# Altium project STM32-PanTilt.PrjPcb
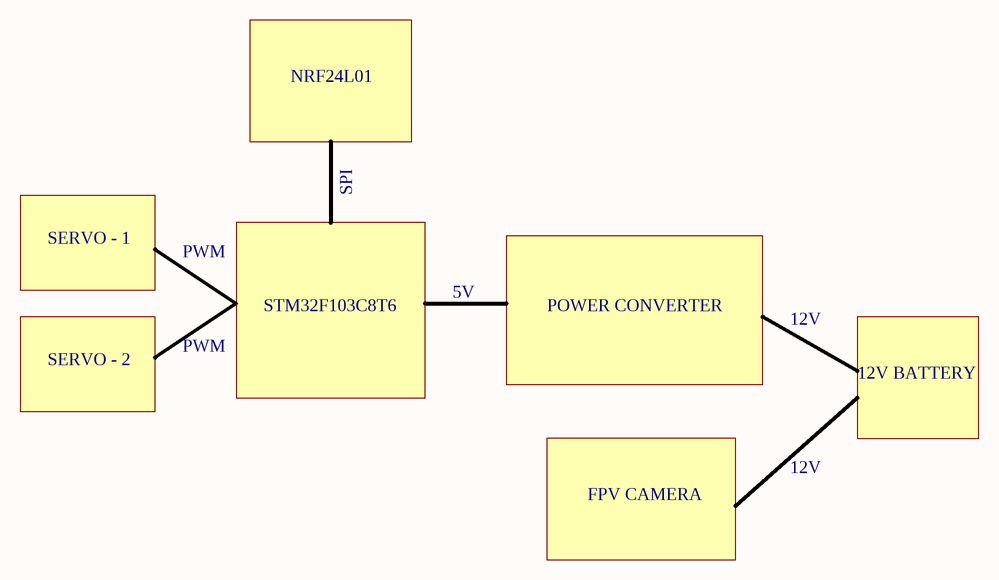
[diagram p0: BlockDiagram.SchDoc]
2 sheets, 48 parts. Net scope: global (net labels, ports and power ports of the same name join across sheets).
Board file: PCB1.PcbDoc
Sheets:
  BlockDiagram.SchDoc
  Schematic.SchDoc

## Sheet BlockDiagram.SchDoc
size A4; SheetNumber: 1; SheetTotal: 1

### Notes on the sheet
- NRF24L01
- SPI
- SERVO - 1
- PWM
- STM32F103C8T6
- 5V
- POWER CONVERTER
- 12V
- SERVO - 2
- 12V BATTERY
- FPV CAMERA

## Sheet Schematic.SchDoc
size A4; SheetNumber: 2; SheetTotal: 2
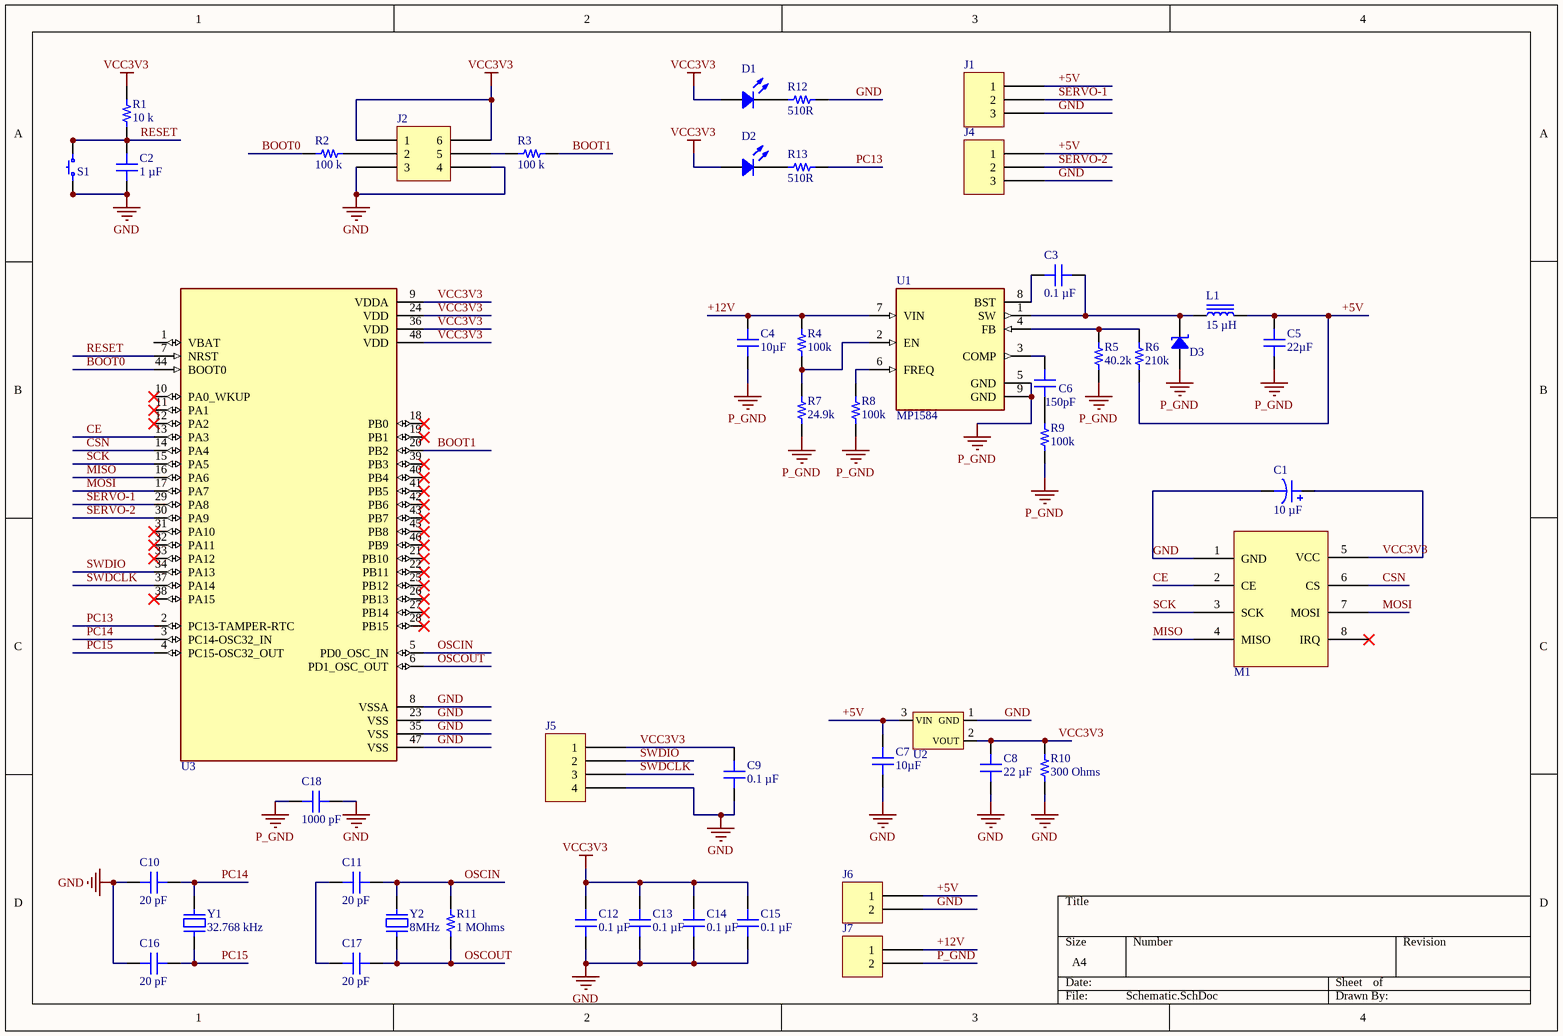
[diagram p1: Schematic.SchDoc]

### Parts
C1  10 µF  [CAP ALSMD 4.3MM H5.4MM]
C2  1 µF  [CAP 0603_1608]
C3  0.1 µF  [CAP 0603_1608]
C4  10µF  [CAP 0805_2012]
C5  22µF  [CAP 0603_1608]
C6  150pF  [CAP 0603_1608]
C7  10µF  [CAP 0603_1608]
C8  22 µF  [CAP 0603_1608]
C9  0.1 µF  [CAP 0603_1608]
C10  20 pF  [CAP 0603_1608]
C11  20 pF  [CAP 0603_1608]
C12  0.1 µF  [CAP 0603_1608]
C13  0.1 µF  [CAP 0603_1608]
C14  0.1 µF  [CAP 0603_1608]
C15  0.1 µF  [CAP 0603_1608]
C16  20 pF  [CAP 0603_1608]
C17  20 pF  [CAP 0603_1608]
C18  1000 pF  [CAP 0603_1608]
D1  Red  [LED 1206_3216 RED]  (value not drawn)
D2  Red  [LED 1206_3216 RED]  (value not drawn)
D3  SMF36A-E3-08  [SMF DO-219AB]  (value not drawn)
J1  B3B-PH-K-S(LF)(SN)  [JST B3B-PH-K]  (value not drawn)
J2  M20-7830342  [HARWIN M20-7830345]  (value not drawn)
J4  B3B-PH-K-S(LF)(SN)  [JST B3B-PH-K]  (value not drawn)
J5  NPPN041BFCN-RC  [SULLINS NPPN041BFCN]  (value not drawn)
J6  OQ0232510000G  [FCI 06-381-2PIN]  (value not drawn)
J7  OQ0232510000G  [FCI 06-381-2PIN]  (value not drawn)
L1  15 µH  [BOURNS SRR1280]
M1  NRF24L01  [NRF24L01]  (value not drawn)
R1  10 k  [RES 0603_1608]
R2  100 k  [RES 0603_1608]
R3  100 k  [RES 0603_1608]
R4  100k  [RES 0603_1608]
R5  40.2k  [RES 0603_1608]
R6  210k  [RES 0603_1608]
R7  24.9k  [RES 0603_1608]
R8  100k  [RES 0603_1608]
R9  100k  [RES 0603_1608]
R10  300 Ohms  [RES 0603_1608]
R11  1 MOhms  [RES 0603_1608]
R12  510R  [RES 0603_1608]
R13  510R  [RES 0603_1608]
S1  1-1977223-1  [TE FSM4JSMA]  (value not drawn)
U1  MP1584  [8-SOIC]
U2  AMS1117-3.3V  [SOT223]  (value not drawn)
U3  STM32F103C8T6  [QFP50P900X900X160-48N]  (value not drawn)
Y1  32.768 kHz  [ABRACON ABS25]
Y2  8MHz  [ABRACON ABLS]

### Nets
GND: C1.2 C2.1 C7.1 C8.1 C9.1 C10.1 C12.1 C13.1 C14.1 C15.1 C16.1 C18.2 J1.3 J2.3 J2.4 J4.3 J5.4 J6.2 M1.1(GND) R10.1 R12.2 S1.1 S1.2 U2.1(GND) U3.8(VSSA) U3.23(VSS) U3.35(VSS) U3.47(VSS)
P_GND: C4.1 C5.1 C18.1 D3.1 J7.2 R5.1 R7.1 R8.1 R9.1 U1.5(GND) U1.9(GND)
VCC3V3: C1.1 C8.2 C9.2 C12.2 C13.2 C14.2 C15.2 D1.1 D2.1 J2.1 J2.6 J5.1 M1.5(VCC) R1.2 R10.2 U2.2(VOUT) U3.9(VDDA) U3.24(VDD) U3.36(VDD) U3.48(VDD)
+5V: C5.2 C7.2 J1.1 J4.1 J6.1 L1.2 R6.1 U2.3(VIN)
+12V: C4.2 J7.1 R4.2 U1.7(VIN)
BOOT0: R2.1 U3.44(BOOT0)
BOOT1: R3.2 U3.20(PB2)
CE: M1.2(CE) U3.13(PA3)
CSN: M1.6(CS) U3.14(PA4)
MISO: M1.4(MISO) U3.16(PA6)
MOSI: M1.7(MOSI) U3.17(PA7)
OSCIN: C11.2 R11.2 U3.5(PD0_OSC_IN) Y2.2
OSCOUT: C17.2 R11.1 U3.6(PD1_OSC_OUT) Y2.1
PC13: R13.2 U3.2(PC13-TAMPER-RTC)
PC14: C10.2 U3.3(PC14-OSC32_IN) Y1.1
PC15: C16.2 U3.4(PC15-OSC32_OUT) Y1.4
RESET: C2.2 R1.1 S1.3 S1.4 U3.7(NRST)
SCK: M1.3(SCK) U3.15(PA5)
SERVO-1: J1.2 U3.29(PA8)
SERVO-2: J4.2 U3.30(PA9)
SWDCLK: J5.3 U3.37(PA14)
SWDIO: J5.2 U3.34(PA13)
NetC3_1: C3.1 U1.8(BST)
NetC3_2: C3.2 D3.2 L1.1 U1.1(SW)
NetC6_1: C6.1 R9.2
NetC6_2: C6.2 U1.3(COMP)
NetC11_1: C11.1 C17.1
NetD1_2: D1.2 R12.1
NetD2_2: D2.2 R13.1
NetJ2_2: J2.2 R2.2
NetJ2_5: J2.5 R3.1
NetR4_1: R4.1 R7.2 U1.2(EN)
NetR5_2: R5.2 R6.2 U1.4(FB)
NetR8_2: R8.2 U1.6(FREQ)

Not connected (* = marked no-connect by the designer): M1 8(IRQ)*; U3 1(VBAT) 10(PA0_WKUP)* 11(PA1)* 12(PA2)* 18(PB0)* 19(PB1)* 21(PB10)* 22(PB11)* 25(PB12)* 26(PB13)* 27(PB14)* 28(PB15)* 31(PA10)* 32(PA11)* 33(PA12)* 38(PA15)* 39(PB3)* 40(PB4)* 41(PB5)* 42(PB6)* 43(PB7)* 45(PB8)* 46(PB9)*

### Library data of the parts
C1 = UWX1C100MCL1GB: CAP ALUM 10UF 20% 16V SMD; manufacturer: Nichicon; Lifetime @ Temp.: 2000 Hrs @ 85°C; Polarization: Polar; Ripple Current @ High Frequency: 34.5 mA @ 10 kHz; Ripple Current @ Low Frequency: 23 mA @ 120 Hz; Surface Mount Land Size: 0.169" L x 0.169" W (4.30mm x 4.30mm); Part Number: UWX1C100MCL1GB; Applications: General Purpose; Capacitance: 10 µF; componentlink1description: Datasheet; componentlink1url: https://products.nichicon.co.jp/en/pdf/XJA043/e-uwx.pdf; componentlink2description: DigiKey Link; componentlink2url: https://www.digikey.com/en/products/detail/nichicon/UWX1C100MCL1GB/589841; Device Package: Radial, Can - SMD; Height - Seated (Max): 0.213" (5.40mm); lastupdated: 4.02.2023 20:43:08; Lifecycle Status: Active; Minimum Order: 1; Mounting Type: Surface Mount; Operating Temperature: -40°C ~ 85°C; Package / Case: Radial, Can - SMD; packaging: TapeAndReel; partid: 7030; Part Status: Active; price: 0.06; series: UWX; Size / Dimension: 0.157" Dia (4.00mm); Supplier 1: DigiKey; Supplier Part Number 1: 493-2100-1-ND; Tolerance: ±20%; value: 10 µF; Voltage - Rated: 16 V
C2 = C0603C105K4RACAUTO: CAP CER 1UF 16V X7R 0603; manufacturer: KEMET; Tolerance: ±10%; Part Number: C0603C105K4RACAUTO; Value: 1 µF; Applications: Automotive, Bypass, Decoupling; Capacitance: 1 µF; componentlink1description: Datasheet; componentlink1url: https://api.kemet.com/component-edge/download/datasheet/C0603C105K4RACAUTO.pdf; componentlink2description: DigiKey Link; componentlink2url: https://www.digikey.com/en/products/detail/kemet/C0603C105K4RACAUTO/8635831; Device Package: 0603 (1608 Metric); lastupdated: 4.02.2023 20:08:09; Lifecycle Status: Active; Minimum Order: 0; Mounting Type: Surface Mount, MLCC; Operating Temperature: -55°C ~ 125°C; Package / Case: 0603 (1608 Metric); partid: 2179; Part Status: Active; price: 0; Ratings: AEC-Q200; series: SMD Auto X7R; Size / Dimension: 0.063" L x 0.031" W (1.60mm x 0.80mm); Supplier 1: DigiKey; Supplier Part Number 1: 399-17704-2-ND; Temperature Coefficient: X7R; Thickness (Max): 0.037" (0.95mm); Voltage - Rated: 16V
C3 = C0603C104K5RAC7411: CAP CER 0.1UF 50V X7R 0603; manufacturer: KEMET; Tolerance: ±10%; Part Number: C0603C104K5RAC7411; Value: 0.1 µF; Applications: Bypass, Decoupling; Capacitance: 0.1 µF; componentlink1description: Datasheet; componentlink1url: https://api.kemet.com/component-edge/download/datasheet/C0603C104K5RAC7411.pdf; componentlink2description: DigiKey Link; componentlink2url: https://www.digikey.com/en/products/detail/kemet/C0603C104K5RAC7411/3317013; Device Package: 0603 (1608 Metric); lastupdated: 4.02.2023 20:08:09; Lifecycle Status: Active; Minimum Order: 1; Mounting Type: Surface Mount, MLCC; Operating Temperature: -55°C ~ 125°C; Package / Case: 0603 (1608 Metric); packaging: TapeAndReel; partid: 2233; Part Status: Active; price: 0.01; series: SMD Comm X7R; Size / Dimension: 0.063" L x 0.031" W (1.60mm x 0.80mm); Supplier 1: DigiKey; Supplier Part Number 1: 399-C0603C104K5RAC7411CT-ND; Temperature Coefficient: X7R; Thickness (Max): 0.035" (0.90mm); Voltage - Rated: 50V
C4 = GRM21BR61H106KE43L: CAP CER 10UF 50V X5R 0805; manufacturer: Murata Electronics; Tolerance: ±10%; Part Number: GRM21BR61H106KE43L; Value: 10µF; Applications: General Purpose; Capacitance: 10 µF; componentlink1description: Datasheet; componentlink1url: https://search.murata.co.jp/Ceramy/image/img/A01X/G101/ENG/GRM21BR61H106KE43-01A.pdf; componentlink2description: DigiKey Link; componentlink2url: https://www.digikey.com/en/products/detail/murata-electronics/GRM21BR61H106KE43L/10326316; Device Package: 0805 (2012 Metric); lastupdated: 4.02.2023 20:11:05; Lifecycle Status: Active; Minimum Order: 1; Mounting Type: Surface Mount, MLCC; Operating Temperature: -55°C ~ 85°C; Package / Case: 0805 (2012 Metric); packaging: TapeAndReel; partid: 39284; Part Status: Active; price: 0.05; series: GRM; Size / Dimension: 0.079" L x 0.049" W (2.00mm x 1.25mm); Supplier 1: DigiKey; Supplier Part Number 1: 490-18663-1-ND; Temperature Coefficient: X5R; Thickness (Max): 0.057" (1.45mm); Voltage - Rated: 50V
C5 = 06036D226MAT2A: CAP CER 22UF 6.3V X5R 0603; manufacturer: AVX Corporation; Tolerance: ±20%; Part Number: 06036D226MAT2A; Value: 22µF; Applications: General Purpose; Capacitance: 22µF; componentlink1description: Datasheet; componentlink1url: http://datasheets.avx.com/cx5r.pdf; componentlink2description: DigiKey Link; componentlink2url: http://digikey.com/product-detail/en/avx-corporation/06036D226MAT2A/478-10812-1-ND/7536349; Device Package: 0603 (1608 Metric); lastupdated: 2.09.2020 01:03:16; Lifecycle Status: Active; Minimum Order: 1; Mounting Type: Surface Mount, MLCC; Operating Temperature: -55°C ~ 85°C; Package / Case: 0603 (1608 Metric); packaging: TapeAndReel; partid: 13180; Part Status: Active; price: 0.10; series: -; Size / Dimension: 0.063" L x 0.032" W (1.60mm x 0.81mm); Supplier 1: DigiKey; Supplier Part Number 1: 478-10812-1-ND; Temperature Coefficient: X5R; Thickness (Max): 0.040" (1.02mm); Voltage - Rated: 6.3V
C6 = 885012206029: CAP CER 150PF 16V X7R 0603; manufacturer: Würth Elektronik; Tolerance: ±10%; Part Number: 885012206029; Value: 150pF; Applications: General Purpose; Capacitance: 150 pF; componentlink1description: Datasheet; componentlink1url: https://katalog.we-online.de/pbs/datasheet/885012206029.pdf; componentlink2description: DigiKey Link; componentlink2url: https://www.digikey.com/en/products/detail/würth-elektronik/885012206029/5453803; Device Package: 0603 (1608 Metric); lastupdated: 4.02.2023 20:08:05; Lifecycle Status: Active; Minimum Order: 1; Mounting Type: Surface Mount, MLCC; Operating Temperature: -55°C ~ 125°C; Package / Case: 0603 (1608 Metric); packaging: TapeAndReel; partid: 3529; Part Status: Active; price: 0.02; series: WCAP-CSGP; Size / Dimension: 0.063" L x 0.031" W (1.60mm x 0.80mm); Supplier 1: DigiKey; Supplier Part Number 1: 732-7948-1-ND; Temperature Coefficient: X7R; Thickness (Max): 0.034" (0.87mm); Voltage - Rated: 16V
C7 = GRM188R60J106ME47D: CAP CER 10UF 6.3V X5R 0603; manufacturer: Murata Electronics; Tolerance: ±20%; Part Number: GRM188R60J106ME47D; Value: 10µF; Applications: General Purpose; Capacitance: 10 µF; componentlink1description: Datasheet; componentlink1url: https://www.murata.com/~/media/webrenewal/support/library/catalog/products/capacitor/mlcc/c02e.ashx?la=en-us; componentlink2description: DigiKey Link; componentlink2url: https://www.digikey.com/en/products/detail/murata-electronics/GRM188R60J106ME47D/965910; Device Package: 0603 (1608 Metric); lastupdated: 4.02.2023 20:08:08; Lifecycle Status: Active; Minimum Order: 1; Mounting Type: Surface Mount, MLCC; Operating Temperature: -55°C ~ 85°C; Package / Case: 0603 (1608 Metric); packaging: TapeAndReel; partid: 2351; Part Status: Active; price: 0.02; series: GRM; Size / Dimension: 0.063" L x 0.031" W (1.60mm x 0.80mm); Supplier 1: DigiKey; Supplier Part Number 1: 490-3896-1-ND; Temperature Coefficient: X5R; Thickness (Max): 0.035" (0.90mm); Voltage - Rated: 6.3V
C8 = GRM186R60J226ME15D: CAP CER 22UF 6.3V X5R 0603; manufacturer: Murata Electronics; Tolerance: ±20%; Part Number: GRM186R60J226ME15D; Value: 22 µF; Applications: General Purpose; Capacitance: 22 µF; componentlink1description: Datasheet; componentlink1url: https://psearch.en.murata.com/capacitor/product/GRM186R60J226ME15%23.pdf; componentlink2description: DigiKey Link; componentlink2url: https://www.digikey.com/en/products/detail/murata-electronics/GRM186R60J226ME15D/5877404; Device Package: 0603 (1608 Metric); lastupdated: 4.02.2023 20:08:08; Lifecycle Status: Active; Minimum Order: 1; Mounting Type: Surface Mount, MLCC; Operating Temperature: -55°C ~ 85°C; Package / Case: 0603 (1608 Metric); packaging: TapeAndReel; partid: 2353; Part Status: Active; price: 0.05; series: GRM; Size / Dimension: 0.063" L x 0.031" W (1.60mm x 0.80mm); Supplier 1: DigiKey; Supplier Part Number 1: 490-13241-1-ND; Temperature Coefficient: X5R; Thickness (Max): 0.024" (0.60mm); Voltage - Rated: 6.3V
C9 C12-C15 = CS0603KRX7R7BB104: CAP CER 0.1UF 16V X7R 0603; manufacturer: Yageo; Tolerance: ±10%; Part Number: CS0603KRX7R7BB104; Value: 0.1 µF; Applications: Boardflex Sensitive; Capacitance: 0.1 µF; componentlink1description: Datasheet; componentlink1url: http://www.yageo.com/NewPortal/yageodocoutput?fileName=/pdf/MLCC/UPY-ST_NPOX7R_16V-to-3KV_5.pdf; componentlink2description: DigiKey Link; componentlink2url: https://www.digikey.com/en/products/detail/yageo/CS0603KRX7R7BB104/6097897; Device Package: 0603 (1608 Metric); Features: Soft Termination; lastupdated: 4.02.2023 20:08:08; Lifecycle Status: Active; Minimum Order: 1; Mounting Type: Surface Mount, MLCC; Operating Temperature: -55°C ~ 125°C; Package / Case: 0603 (1608 Metric); packaging: TapeAndReel; partid: 2286; Part Status: Active; price: 0.01; series: CS; Size / Dimension: 0.063" L x 0.031" W (1.60mm x 0.80mm); Supplier 1: DigiKey; Supplier Part Number 1: 311-3560-1-ND; Temperature Coefficient: X7R; Thickness (Max): 0.037" (0.95mm); Voltage - Rated: 16V
C10 C11 C16 C17 = C0603C200K4GAC7867: CAP CER 20PF 16V NP0 0603; manufacturer: KEMET; Temperature Coefficient: C0G, NP0; Tolerance: ±10%; Part Number: C0603C200K4GAC7867; Value: 20 pF; Applications: General Purpose; Capacitance: 20 pF; componentlink1description: Datasheet; componentlink1url: https://api.kemet.com/component-edge/download/datasheet/C0603C200K4GACTU.pdf; componentlink2description: DigiKey Link; componentlink2url: https://www.digikey.com/en/products/detail/kemet/C0603C200K4GAC7867/2200148; Device Package: 0603 (1608 Metric); Features: Low ESL; lastupdated: 4.02.2023 20:08:00; Lifecycle Status: Active; Minimum Order: 1; Mounting Type: Surface Mount, MLCC; Operating Temperature: -55°C ~ 125°C; Package / Case: 0603 (1608 Metric); packaging: TapeAndReel; partid: 5328; Part Status: Active; price: 0.04; series: SMD Comm C0G; Size / Dimension: 0.063" L x 0.031" W (1.60mm x 0.80mm); Supplier 1: DigiKey; Supplier Part Number 1: 399-14498-1-ND; Thickness (Max): 0.034" (0.87mm); Voltage - Rated: 16V
C18 = C0603C102K4RECAUTO: CAP CER 0603 1NF 16V X7R 10%; manufacturer: KEMET; Part Number: C0603C102K4RECAUTO; Value: 1000 pF; Applications: Automotive, ESD Protection; Capacitance: 1000 pF; componentlink1description: Datasheet; componentlink1url: https://api.kemet.com/component-edge/download/datasheet/C0603C102K4RECAUTO.pdf; componentlink2description: DigiKey Link; componentlink2url: https://www.digikey.com/en/products/detail/kemet/C0603C102K4RECAUTO/8640472; Device Package: 0603 (1608 Metric); lastupdated: 5.02.2023 20:08:00; Lifecycle Status: Active; Minimum Order: 1; Mounting Type: Surface Mount, MLCC; Operating Temperature: -55°C ~ 125°C; Package / Case: 0603 (1608 Metric); packaging: TapeAndReel; partid: 2316; Part Status: Active; price: 0.01; Ratings: AEC-Q200; series: ESD SMD Auto X7R; Size / Dimension: 0.063" L x 0.031" W (1.60mm x 0.80mm); Supplier 1: DigiKey; Supplier Part Number 1: 399-17878-1-ND; Temperature Coefficient: X7R; Thickness (Max): 0.034" (0.87mm); Tolerance: ±10%; Voltage - Rated: 16V
D1 D2 = APTD3216EC: LED RED CLEAR 2SMD; Manufacturer: Kingbright; Configuration: Standard; Current - Test: 20mA; Lens Color: Colorless; Lens Size: 1.60mm Dia; Lens Style: Round with Domed Top; Millicandela Rating: 50mcd; Viewing Angle: 35°; Voltage - Forward (Vf) (Typ): 2V; Wavelength - Dominant: 617nm; Wavelength - Peak: 627nm; Part Number: APTD3216EC; Color: Red; ComponentLink1Description: Datasheet; ComponentLink1URL: http://www.kingbrightusa.com/images/catalog/SPEC/APTD3216EC.pdf; ComponentLink2Description: DigiKey Link; ComponentLink2URL: https://www.digikey.com/en/products/detail/kingbright/APTD3216EC/1747552; Device Package: 1206 (3216 Metric); Height (Max): 1.90mm; LastUpdated: 4.02.2023 20:48:33; Lens Transparency: Clear; Lifecycle Status: Active; Minimum Order: 1; Mounting Type: Surface Mount; Package / Case: 1206 (3216 Metric); Packaging: TapeAndReel; PartId: 193; Part Status: Active; Price: 0.07; Series: -; Size / Dimension: 3.20mm L x 1.60mm W; Supplier 1: DigiKey; Supplier Part Number 1: 754-1153-1-ND; Supplier Device Package: 2-SMD; Value: Red
D3 = SMF36A-E3-08: TVS DIODE 36V 58.1V SMF; Manufacturer: Vishay Semiconductor Diodes Division; Capacitance @ Frequency: 178pF @ 1MHz; Current - Peak Pulse (10/1000µs): 3.4A; Power Line Protection: No; Power - Peak Pulse: 200W; Type: Zener; Unidirectional Channels: 1; Voltage - Breakdown (Min): 40V; Part Number: SMF36A-E3-08; Applications: General Purpose; ComponentLink1Description: Datasheet; ComponentLink1URL: http://www.vishay.com/docs/85881/smf5v0atosmf58a.pdf; ComponentLink2Description: DigiKey Link; ComponentLink2URL: http://digikey.com/product-detail/en/vishay-semiconductor-diodes-division/SMF36A-E3-08/SMF36A-E3-08CT-ND/1680635; LastUpdated: 4.02.2023 21:00:37; Lifecycle Status: Active; Minimum Order: 1; Mounting Type: Surface Mount; Operating Temperature: -65°C ~ 175°C (TJ); Package / Case: DO-219AB; Packaging: TapeAndReel; PartId: 5530; Part Status: Active; Price: 0.10; Series: -; Supplier 1: DigiKey; Supplier Part Number 1: SMF36A-E3-08CT-ND; Supplier Device Package: SMF; Voltage - Clamping (Max) @ Ipp: 58.1V; Voltage - Reverse Standoff (Typ): 36V
J1 J4 = B3B-PH-K-S(LF)(SN): CONN HEADER VERT 3POS 2MM; Manufacturer: JST Sales America Inc.; Contact Length - Mating: 0.130" (3.30mm); Contact Length - Post: 0.134" (3.40mm); Current Rating (Amps): 2A; Material Flammability Rating: UL94 V-0; Number of Positions: 3; Number of Positions Loaded: All; Overall Contact Length: 0.333" (8.45mm); Pitch - Mating: 0.079" (2.00mm); Shrouding: Shrouded - 4 Wall; Style: Board to Cable/Wire; Voltage Rating: 100V; Part Number: B3B-PH-K-S(LF)(SN); ComponentLink1Description: Datasheet; ComponentLink1URL: http://www.jst-mfg.com/product/pdf/eng/ePH.pdf; ComponentLink2Description: DigiKey Link; ComponentLink2URL: http://digikey.com/product-detail/en/jst-sales-america-inc/B3B-PH-K-S-LF-SN/455-1705-ND/926612; Connector Type: Header; Contact Finish - Mating: Tin; Contact Finish - Post: Tin; Contact Material: Brass; Contact Shape: Square; Contact Type: Male Pin; Fastening Type: Detent Lock; Insulation Color: Natural; Insulation Height: 0.236" (6.00mm); Insulation Material: Polyamide (PA66), Nylon 6/6; LastUpdated: 12.01.2020 22:29:26; Lifecycle Status: Active; Minimum Order: 1; Mounting Type: Through Hole; Number of Rows: 1; Operating Temperature: -25°C ~ 85°C; Packaging: Bulk; PartId: 26; Part Status: Active; Price: 0.19; Series: PH; Supplier 1: DigiKey; Supplier Part Number 1: 455-1705-ND; Termination: Press-Fit, Solder
J2 = M20-7830342: CONN RCPT 6POS 0.1 GOLD PCB; Manufacturer: Harwin Inc.; Connector Type: Receptacle; Contact Length - Post: 0.118" (3.00mm); Current Rating (Amps): 3A; Mated Stacking Heights: 11.04mm, 12.63mm; Material Flammability Rating: UL94 V-0; Number of Positions: 6; Number of Positions Loaded: All; Pitch - Mating: 0.100" (2.54mm); Style: Board to Board or Cable; Part Number: M20-7830342; ComponentLink1Description: Datasheet; ComponentLink1URL: https://cdn.harwin.com/pdfs/Harwin_PC_Connectors_M20.pdf; ComponentLink2Description: DigiKey Link; ComponentLink2URL: https://www.digikey.com/en/products/detail/harwin-inc/M20-7830342/3727749; Contact Finish - Mating: Gold; Contact Finish - Post: Tin; Contact Finish Thickness - Mating: Flash; Contact Type: Female Socket; Fastening Type: Push-Pull; Insulation Color: Black; Insulation Height: 0.335" (8.51mm); LastUpdated: 21.09.2022 19:03:32; Lifecycle Status: Active; Minimum Order: 1; Mounting Type: Through Hole; Number of Rows: 2; Operating Temperature: -40°C ~ 105°C; Packaging: Tube; Part Status: Active; Price: 0.67; Row Spacing - Mating: 0.100" (2.54mm); Series: M20; Supplier 1: DigiKey; Supplier Part Number 1: 952-1780-ND; Termination: Solder
J5 = NPPN041BFCN-RC: CONN HDR 4POS 0.079 GOLD PCB; Manufacturer: Sullins Connector Solutions; Connector Type: Header; Contact Length - Post: 0.094" (2.40mm); Current Rating (Amps): 2A; Material Flammability Rating: UL94 V-0; Number of Positions: 4; Number of Positions Loaded: All; Pitch - Mating: 0.079" (2.00mm); Style: Board to Board; Part Number: NPPN041BFCN-RC; ComponentLink1Description: Datasheet; ComponentLink1URL: https://drawings-pdf.s3.amazonaws.com/10483.pdf; ComponentLink2Description: DigiKey Link; ComponentLink2URL: https://www.digikey.com/en/products/detail/sullins-connector-solutions/NPPN041BFCN-RC/804806; Contact Finish - Mating: Gold; Contact Finish - Post: Gold; Contact Finish Thickness - Mating: Flash; Contact Type: Female Socket; Fastening Type: Push-Pull; Insulation Color: Black; Insulation Height: 0.173" (4.40mm); LastUpdated: 21.06.2022 14:42:51; Lifecycle Status: Active; Minimum Order: 1; Mounting Type: Through Hole; Number of Rows: 1; Operating Temperature: -40°C ~ 105°C; Packaging: Tube; Part Status: Active; Price: 0.30; Series: -; Supplier 1: DigiKey; Supplier Part Number 1: S5751-04-ND; Termination: Solder
J6 J7 = OQ0232510000G: TERM BLOCK HDR 2POS 90DEG 3.81MM; Manufacturer: Amphenol Anytek; Current - UL: 10A; Header Orientation: 90°, Right Angle; Number of Levels: 1; Number of Positions: 2; Pitch: 0.150" (3.81mm); Voltage - UL: 300V; Part Number: OQ0232510000G; Color: Green; ComponentLink1Description: Datasheet; ComponentLink1URL: http://portal.fciconnect.com/Comergent//fci/drawing/oqxx32x100j0g.pdf; ComponentLink2Description: DigiKey Link; ComponentLink2URL: //digikey.com/product-detail/en/amphenol-anytek/OQ0232510000G/609-3819-ND/2261255; Contact Mating Finish: Tin; LastUpdated: 16.12.2019 19:14:30; Lifecycle Status: 0; Minimum Order: 1; Mounting Type: Through Hole; Operating Temperature: -40°C ~ 115°C; Packaging: Bulk; Part Status: Active; Positions Per Level: 2; Price: 0.49; Series: 06-381; Supplier 1: DigiKey; Supplier Part Number 1: 609-3819-ND; Termination Style: Solder; Type: Header, Male Pins, Shrouded (4 Side)
L1 = SRR1280-150M: FIXED IND 15UH 5.2A 28.5MOHM SMD; Manufacturer: Bourns Inc.; Current - Saturation: 5A; DC Resistance (DCR): 28.5mOhm Max; Frequency - Self Resonant: 13MHz; Inductance Frequency - Test: 100 kHz; Material - Core: Ferrite; Q @ Freq: 26 @ 2.52MHz; Shielding: Shielded; Tolerance: ±20%; Type: Drum Core, Wirewound; Part Number: SRR1280-150M; ComponentLink1Description: Datasheet; ComponentLink1URL: https://www.bourns.com/docs/Product-Datasheets/SRR1280.pdf; ComponentLink2Description: DigiKey Link; ComponentLink2URL: https://www.digikey.com/en/products/detail/bourns-inc/SRR1280-150M/1969994; Current Rating (Amps): 5.2 A; Device Package: Nonstandard; Height - Seated (Max): 0.315" (8.00mm); Inductance: 15 µH; LastUpdated: 4.02.2023 20:50:03; Lifecycle Status: Active; Minimum Order: 1; Mounting Type: Surface Mount; Operating Temperature: -40°C ~ 125°C; Package / Case: Nonstandard; Packaging: TapeAndReel; PartId: 20; Part Status: Active; Price: 0.54; Series: SRR1280; Size / Dimension: 0.492" L x 0.492" W (12.50mm x 12.50mm); Supplier 1: DigiKey; Supplier Part Number 1: SRR1280-150MCT-ND; Value: 15 µH
M1 = NRF24L01: NRF24L01+MODULE; Manufacturer: Seeed Studio; Manufacturer Part Number: 113990011; Interface: SPI; Frequency: 2.4GHz; Data Rate: 2Mbps; Sensitivity: -85dBm; Current - Receiving: 12.3mA; Current - Transmitting: 11.3mA; Designed by: Semih AŞÇI; Supplier 1: Digi-Key; RoHS: No; Mount: Surface Mount; Case/Package: SMD/SMT; Min Operating Temperature: -40°C; Max Operating Temperature: 85°C; Packaging: Bulk; ComponentLink1URL: http://www.seeedstudio.com/document/pdf/DS_nRF24L01.pdf?src-supplier=Digi-Key; ComponentLink1Description: http://www.seeedstudio.com/document/pdf/DS_nRF24L01.pdf?src-supplier=Digi-Key; Supplier Part Number 1: 1597-1352-ND
R1 = RNCS0603BKE10K0: RES 10K OHM 0.1% 1/16W 0603; Manufacturer: Stackpole Electronics Inc; Power (Watts): 0.063W, 1/16W; Resistance: 10 kOhms; Temperature Coefficient: ±25ppm/°C; Part Number: RNCS0603BKE10K0; Value: 10 k; ComponentLink1Description: Datasheet; ComponentLink1URL: https://www.seielect.com/catalog/sei-rncs_rnch.pdf; ComponentLink2Description: DigiKey Link; ComponentLink2URL: https://www.digikey.com/en/products/detail/stackpole-electronics-inc/RNCS0603BKE10K0/1708836; Composition: Thin Film; Device Package: 0603 (1608 Metric); Features: Anti-Corrosive, Automotive AEC-Q200, Moisture Resistant; Height - Seated (Max): 0.022" (0.55mm); LastUpdated: 3.02.2023 20:29:34; Lifecycle Status: Active; Minimum Order: 1; Number of Terminations: 2; Operating Temperature: -55°C ~ 155°C; Package / Case: 0603 (1608 Metric); Packaging: TapeAndReel; PartId: 4838; Part Status: Active; Price: 0.07; Ratings: AEC-Q200; Series: RNCS; Size / Dimension: 0.061" L x 0.031" W (1.55mm x 0.80mm); Supplier 1: DigiKey; Supplier Part Number 1: RNCS0603BKE10K0CT-ND; Supplier Device Package: 0603; Tolerance: ±0.1%
R2-R4 R8 R9 = RNCS0603BKE100K: RES 100K OHM 0.1% 1/16W 0603; Manufacturer: Stackpole Electronics Inc; Power (Watts): 0.063W, 1/16W; Resistance: 100 kOhms; Temperature Coefficient: ±25ppm/°C; Part Number: RNCS0603BKE100K; ComponentLink1Description: Datasheet; ComponentLink1URL: https://www.seielect.com/catalog/sei-rncs_rnch.pdf; ComponentLink2Description: DigiKey Link; ComponentLink2URL: https://www.digikey.com/en/products/detail/stackpole-electronics-inc/RNCS0603BKE100K/1708835; Composition: Thin Film; Device Package: 0603 (1608 Metric); Features: Anti-Corrosive, Automotive AEC-Q200, Moisture Resistant; Height - Seated (Max): 0.022" (0.55mm); LastUpdated: 3.02.2023 20:29:34; Lifecycle Status: Active; Minimum Order: 1; Number of Terminations: 2; Operating Temperature: -55°C ~ 155°C; Package / Case: 0603 (1608 Metric); Packaging: TapeAndReel; PartId: 4849; Part Status: Active; Price: 0.08; Ratings: AEC-Q200; Series: RNCS; Size / Dimension: 0.061" L x 0.031" W (1.55mm x 0.80mm); Supplier 1: DigiKey; Supplier Part Number 1: RNCS0603BKE100KCT-ND; Supplier Device Package: 0603; Tolerance: ±0.1%
  R2 R3: Value: 100 k
  R4 R8 R9: Value: 100k
R5 = RQ73C1J40K2BTDF: RQ 0603 40K2 0.1% 10PPM 1K RL; Manufacturer: TE Connectivity Passive Product; Power (Watts): 0.15W; Resistance: 40.2 kOhms; Temperature Coefficient: ±10ppm/°C; Part Number: RQ73C1J40K2BTDF; Value: 40.2k; ComponentLink1Description: Datasheet; ComponentLink1URL: https://www.te.com/commerce/DocumentDelivery/DDEController?Action=srchrtrv&DocNm=1773270-2&DocType=DS&DocLang=English; ComponentLink2Description: DigiKey Link; ComponentLink2URL: https://www.digikey.com/en/products/detail/te-connectivity-passive-product/RQ73C1J40K2BTDF/13957340; Composition: Thin Film; Device Package: 0603 (1608 Metric); Features: Anti-Sulfur, Automotive AEC-Q200, Moisture Resistant; Height - Seated (Max): 0.022" (0.55mm); LastUpdated: 3.02.2023 20:27:29; Lifecycle Status: Active; Minimum Order: 1; Number of Terminations: 2; Operating Temperature: -55°C ~ 155°C; Package / Case: 0603 (1608 Metric); Packaging: TapeAndReel; PartId: 62224; Part Status: Active; Price: 0.41; Ratings: AEC-Q200; Series: RQ73; Size / Dimension: 0.061" L x 0.031" W (1.55mm x 0.80mm); Supplier 1: DigiKey; Supplier Part Number 1: 1712-RQ73C1J40K2BTDFCT-ND; Supplier Device Package: 0603; Tolerance: ±0.1%
R6 = RT0603BRD07210KL: RES SMD 210K OHM 0.1% 1/10W 0603; Manufacturer: Yageo; Power (Watts): 0.1W, 1/10W; Resistance: 210 kOhms; Temperature Coefficient: ±25ppm/°C; Part Number: RT0603BRD07210KL; Value: 210k; ComponentLink1Description: Datasheet; ComponentLink1URL: https://www.yageo.com/upload/media/product/productsearch/datasheet/rchip/PYu-RT_1-to-0.01_RoHS_L_11.pdf; ComponentLink2Description: DigiKey Link; ComponentLink2URL: https://www.digikey.com/en/products/detail/yageo/RT0603BRD07210KL/1072353; Composition: Thin Film; Device Package: 0603 (1608 Metric); Height - Seated (Max): 0.022" (0.55mm); LastUpdated: 3.02.2023 20:29:29; Lifecycle Status: Active; Minimum Order: 1; Number of Terminations: 2; Operating Temperature: -55°C ~ 155°C; Package / Case: 0603 (1608 Metric); Packaging: TapeAndReel; PartId: 6275; Part Status: Active; Price: 0.04; Series: RT; Size / Dimension: 0.063" L x 0.031" W (1.60mm x 0.80mm); Supplier 1: DigiKey; Supplier Part Number 1: YAG4501CT-ND; Supplier Device Package: 0603; Tolerance: ±0.1%
R7 = RQ73C1J24K9BTDF: RQ 0603 24K9 0.1% 10PPM 1K RL; Manufacturer: TE Connectivity Passive Product; Power (Watts): 0.15W; Resistance: 24.9 kOhms; Temperature Coefficient: ±10ppm/°C; Part Number: RQ73C1J24K9BTDF; Value: 24.9k; ComponentLink1Description: Datasheet; ComponentLink1URL: https://www.te.com/commerce/DocumentDelivery/DDEController?Action=srchrtrv&DocNm=1773270-2&DocType=DS&DocLang=English; ComponentLink2Description: DigiKey Link; ComponentLink2URL: https://www.digikey.com/en/products/detail/te-connectivity-passive-product/RQ73C1J24K9BTDF/13941756; Composition: Thin Film; Device Package: 0603 (1608 Metric); Features: Anti-Sulfur, Automotive AEC-Q200, Moisture Resistant; Height - Seated (Max): 0.022" (0.55mm); LastUpdated: 3.02.2023 20:27:33; Lifecycle Status: Active; Minimum Order: 1; Number of Terminations: 2; Operating Temperature: -55°C ~ 155°C; Package / Case: 0603 (1608 Metric); Packaging: TapeAndReel; PartId: 62758; Part Status: Active; Price: 0.41; Ratings: AEC-Q200; Series: RQ73; Size / Dimension: 0.061" L x 0.031" W (1.55mm x 0.80mm); Supplier 1: DigiKey; Supplier Part Number 1: 1712-RQ73C1J24K9BTDFCT-ND; Supplier Device Package: 0603; Tolerance: ±0.1%
R10 = RMCF0603JT300R: RES 300 OHM 5% 1/10W 0603; Manufacturer: Stackpole Electronics Inc; Power (Watts): 0.1W, 1/10W; Temperature Coefficient: ±200ppm/°C; Part Number: RMCF0603JT300R; Value: 300 Ohms; ComponentLink1Description: Datasheet; ComponentLink1URL: https://www.seielect.com/catalog/sei-rmcf_rmcp.pdf; ComponentLink2Description: DigiKey Link; ComponentLink2URL: https://www.digikey.com/en/products/detail/stackpole-electronics-inc/RMCF0603JT300R/1712236; Composition: Thick Film; Device Package: 0603 (1608 Metric); Features: Automotive AEC-Q200; Height - Seated (Max): 0.022" (0.55mm); LastUpdated: 3.02.2023 20:29:31; Lifecycle Status: Active; Minimum Order: 1; Number of Terminations: 2; Operating Temperature: -55°C ~ 155°C; Package / Case: 0603 (1608 Metric); Packaging: CutTape; PartId: 5878; Part Status: Active; Price: 0.01; Ratings: AEC-Q200; Resistance: 300 Ohms; Series: RMCF; Size / Dimension: 0.061" L x 0.031" W (1.55mm x 0.80mm); Supplier 1: DigiKey; Supplier Part Number 1: RMCF0603JT300RCT-ND; Supplier Device Package: 0603; Tolerance: ±5%
R11 = RT0603BRD071ML: RES SMD 1M OHM 0.1% 1/10W 0603; Manufacturer: Yageo; Power (Watts): 0.1W, 1/10W; Temperature Coefficient: ±25ppm/°C; Part Number: RT0603BRD071ML; Value: 1 MOhms; ComponentLink1Description: Datasheet; ComponentLink1URL: https://www.yageo.com/upload/media/product/productsearch/datasheet/rchip/PYu-RT_1-to-0.01_RoHS_L_11.pdf; ComponentLink2Description: DigiKey Link; ComponentLink2URL: https://www.digikey.com/en/products/detail/yageo/RT0603BRD071ML/5927906; Composition: Thin Film; Device Package: 0603 (1608 Metric); Height - Seated (Max): 0.022" (0.55mm); LastUpdated: 3.02.2023 20:29:32; Lifecycle Status: Active; Minimum Order: 1; Number of Terminations: 2; Operating Temperature: -55°C ~ 155°C; Package / Case: 0603 (1608 Metric); Packaging: TapeAndReel; PartId: 5503; Part Status: Active; Price: 0.03; Resistance: 1 MOhms; Series: RT; Size / Dimension: 0.063" L x 0.031" W (1.60mm x 0.80mm); Supplier 1: DigiKey; Supplier Part Number 1: YAG4498CT-ND; Supplier Device Package: 0603; Tolerance: ±0.1%
R12 R13 = RMCF0603JT510R: RES 510 OHM 5% 1/10W 0603; Manufacturer: Stackpole Electronics Inc; Power (Watts): 0.1W, 1/10W; Resistance: 510 Ohms; Temperature Coefficient: ±200ppm/°C; Part Number: RMCF0603JT510R; Value: 510R; ComponentLink1Description: Datasheet; ComponentLink1URL: https://www.seielect.com/catalog/sei-rmcf_rmcp.pdf; ComponentLink2Description: DigiKey Link; ComponentLink2URL: https://www.digikey.com/en/products/detail/stackpole-electronics-inc/RMCF0603JT510R/1757941; Composition: Thick Film; Device Package: 0603 (1608 Metric); Features: Automotive AEC-Q200; Height - Seated (Max): 0.022" (0.55mm); LastUpdated: 5.02.2023 20:28:07; Lifecycle Status: Active; Minimum Order: 1; Number of Terminations: 2; Operating Temperature: -55°C ~ 155°C; Package / Case: 0603 (1608 Metric); Packaging: CutTape; PartId: 5929; Part Status: Active; Price: 0.01; Ratings: AEC-Q200; Series: RMCF; Size / Dimension: 0.061" L x 0.031" W (1.55mm x 0.80mm); Supplier 1: DigiKey; Supplier Part Number 1: RMCF0603JT510RCT-ND; Supplier Device Package: 0603; Tolerance: ±5%
S1 = 1-1977223-1: SWITCH TACTILE SPST-NO 0.05A 24V; Manufacturer: TE Connectivity ALCOSWITCH Switches; Actuator Height off PCB, Vertical: 5.00mm; Actuator Orientation: Top Actuated; Actuator Type: Standard; Contact Rating @ Voltage: 0.05A @ 24VDC; Illumination: Non-Illuminated; Operating Force: 260gf; Outline: 6.00mm x 6.00mm; Switch Function: Off-Mom; Part Number: 1-1977223-1; Circuit: SPST-NO; ComponentLink1Description: Datasheet; ComponentLink1URL: https://www.te.com/commerce/DocumentDelivery/DDEController?Action=srchrtrv&DocNm=1308111-1_SWITCHES_CORE_PROGRAM_CATALOG&DocType=CS&DocLang=English; ComponentLink2Description: DigiKey Link; ComponentLink2URL: http://digikey.com/product-detail/en/te-connectivity-alcoswitch-switches/1-1977223-1/1-1977223-1-ND/5597032; LastUpdated: 4.02.2023 20:59:58; Lifecycle Status: Active; Minimum Order: 0; Mounting Type: Surface Mount; Price: 0; Series: FSMJSMA; Supplier 1: DigiKey; Supplier Part Number 1: 1-1977223-1-ND; Termination Style: Gull Wing
U1 = MP1584EN: IC REG BUCK ADJ 3A; Manufacturer: Monolithic Power Systems; Manufacturer Part Number: MP1584EN-LF-Z; Number of Outputs: 1; Min Input Voltage: 4.5V; Max Input Voltage: 28V; Min Output Voltage: 800mV; Max Output Voltage: 25V; Switching Frequency: 1.5MHz; Synchronous Rectifier: No; Output Type: Adjustable; Output Configuration: Positive; Designed by: Semih AŞÇI; Supplier 1: Digi-Key; RoHS: Yes; Category: Voltage Regulators - Switching; Stock 1: 2500; Pricing 1: 1=2,95000, 10=2,64900, 25=2,50440, 100=2,17040, 250=2,05904, 500=1,84758, 1000=1,57500 (USD); Mount: Surface Mount; Case/Package: SOIC; Number of Pins: 8; Contact Plating: Tin,Matte; Min Operating Temperature: -20°C; Max Operating Temperature: 85°C; Packaging: Tape and Reel; Package Quantity: 2500; Output Current: 3A; Output Voltage: 25V; Operating Supply Voltage: 28V; Max Output Current: 3A; Series: -; Moisture Sensitivity Level: 3; Lead Free: Lead Free; RoHS Compliant: Yes; ComponentLink1URL: http://www.mouser.com/ds/2/277/MP1584_r1.0-779241.pdf?src-supplier=Mouser; ComponentLink1Description: http://www.mouser.com/ds/2/277/MP1584_r1.0-779241.pdf?src-supplier=Mouser; ComponentLink2URL: https://www.monolithicpower.com/pub/media/document/MP1584_r1.0.pdf?src-supplier=Digi-Key; ComponentLink2Description: https://www.monolithicpower.com/pub/media/document/MP1584_r1.0.pdf?src-supplier=Digi-Key; ComponentLink3URL: http://www.monolithicpower.com/Portals/0/Documents/Products/Documents/datasheet/MP1584_r1.0.pdf?src-supplier=Digi-Key; ComponentLink3Description: http://www.monolithicpower.com/Portals/0/Documents/Products/Documents/datasheet/MP1584_r1.0.pdf?src-supplier=Digi-Key; Supplier Part Number 1: 1589-1533-1-ND
U2 = AMS1117-3.3V SMD: 3.3V Voltage regulator; Manufacturer: Advanced Monolithic Systems; Designed by: Semih AŞÇI; Manufacturer Part Number: AMS1117-3.3; RoHS Compliant: Yes
U3 = STM32F103C8T6: IC MCU 32BIT 64KB FLASH 48LQFP; Manufacturer: STMicroelectronics; RAM Size: 20KB; Frequency: 72MHz; Max Power Dissipation: 363mW; Interface: I2C,SPI,USB,CAN,USART; Number of I/Os: 37; Number of Timers/Counters: 3; Max Supply Voltage: 3.6V; Number of ADC Channels: 10; Min Supply Voltage: 2V; Oscillator Type: Internal; Number of Programmable I/O: 48; Data Bus Width: 32b; Number of Bits: 32; Watchdog Timer: Yes; Peripherals: POR,PWM,WDT,DMA,Temp Sensor,I2C; Core Architecture: ARM; Number of PWM Channels: 1; Number of SPI Channels: 2; Designed by: Semih AŞÇI; Supplier 1: Farnell; Manufacturer Part Number: STM32F103C8T6; RoHS: Yes; Category: Microcontrollers; Stock 1: 62494; Pricing 1: 1=8,57000, 10=7,74000, 25=7,39000, 50=7,24000 (EUR); Case/Package: LQFP; Number of Pins: 48; Weight: 0.006349oz; Min Operating Temperature: -40°C; Max Operating Temperature: 85°C; Packaging: Tray; Package Quantity: 1500; Density: 64KB; Memory Type: FLASH; Max Frequency: 72MHz; Memory Size: 64KB; Series: STM32F103C8; Termination: SMD/SMT; Number of I2C Channels: 2; Address Bus Width: 32b; Length: 7mm; Width: 7mm; Height: 1.4mm; Radiation Hardening: No; Lead Free: Lead Free; Reach SVHC Compliant: Yes; RoHS Compliant: Yes; ComponentLink1URL: https://datasheet.ciiva.com/8054/1730126-8054942.pdf?src-supplier=Element14; ComponentLink1Description: https://datasheet.ciiva.com/8054/1730126-8054942.pdf?src-supplier=Element14; ComponentLink2URL: https://datasheet.ciiva.com/14100/pustm-arm-microcont-stm32f103-en-14100508.pdf?src-supplier=Distrelec; ComponentLink2Description: https://datasheet.ciiva.com/14100/pustm-arm-microcont-stm32f103-en-14100508.pdf?src-supplier=Distrelec; ComponentLink3URL: https://datasheet.ciiva.com/48687/001075658-da-01-en-mcu-64kb-mem-stm32f103c8t6-lqfp-48-stm-48687589.pdf?src-supplier=Conrad; ComponentLink3Description: https://datasheet.ciiva.com/48687/001075658-da-01-en-mcu-64kb-mem-stm32f103c8t6-lqfp-48-stm-48687589.pdf?src-supplier=Conrad; Supplier Part Number 1: 1447637
Y1 = ABS25-32.768KHZ-T: CRYSTAL 32.7680KHZ 12.5PF SMD; Manufacturer: Abracon LLC; ESR (Equivalent Series Resistance): 50 kOhms; Frequency Tolerance: ±20ppm; Operating Mode: Fundamental; Part Number: ABS25-32.768KHZ-T; ComponentLink1Description: Datasheet; ComponentLink1URL: https://abracon.com/Resonators/abs25.pdf; ComponentLink2Description: DigiKey Link; ComponentLink2URL: https://www.digikey.com/en/products/detail/abracon-llc/ABS25-32-768KHZ-T/675361; Frequency: 32.768 kHz; Height - Seated (Max): 0.098" (2.50mm); LastUpdated: 4.02.2023 20:49:20; Lifecycle Status: Active; Load Capacitance: 12.5pF; Minimum Order: 1; Mounting Type: Surface Mount; Operating Temperature: -40°C ~ 85°C; Package / Case: 4-SOJ, 5.50mm pitch; Packaging: TapeAndReel; PartId: 391; Part Status: Active; Price: 0.24; Series: ABS25; Size / Dimension: 0.315" L x 0.150" W (8.00mm x 3.80mm); Supplier 1: DigiKey; Supplier Part Number 1: 535-9166-1-ND; Type: kHz Crystal (Tuning Fork); Value: 32.768 kHz
Y2 = ABLS-8.000MHZ-B4H-T: CRYSTAL 8.0000MHZ 18PF SMD; Manufacturer: Abracon LLC; ESR (Equivalent Series Resistance): 80 Ohms; Frequency Stability: ±35ppm; Frequency Tolerance: ±30ppm; Operating Mode: Fundamental; Part Number: ABLS-8.000MHZ-B4H-T; ComponentLink1Description: Datasheet; ComponentLink1URL: https://abracon.com/Resonators/abls.pdf; ComponentLink2Description: DigiKey Link; ComponentLink2URL: http://digikey.com/product-detail/en/abracon-llc/ABLS-8.000MHZ-B4H-T/535-15002-1-ND/9998079; Frequency: 8MHz; Height - Seated (Max): 0.165" (4.20mm); LastUpdated: 4.02.2023 20:49:17; Lifecycle Status: Active; Load Capacitance: 18pF; Minimum Order: 0; Mounting Type: Surface Mount; Operating Temperature: -20°C ~ 70°C; Package / Case: HC-49/US; Packaging: TapeAndReel; PartId: 115; Part Status: Active; Price: 0.18; Series: ABLS; Size / Dimension: 0.449" L x 0.185" W (11.40mm x 4.70mm); Supplier 1: DigiKey; Supplier Part Number 1: 535-15002-1-ND; Type: MHz Crystal; Value: 8MHz